# Altium schematic sheet Leddriver.SchDoc: LED meghajtó áramkör
size A4; ENG_APP_DATE: --/--/--; DSN_APP_DATE: --/--/--; CHK_APP_DATE: --/--/--; Author: Horváth Patrik; Organization: BME-AUT; DocumentNumber: 3; Revision: A29; SheetNumber: 3; SheetTotal: 4
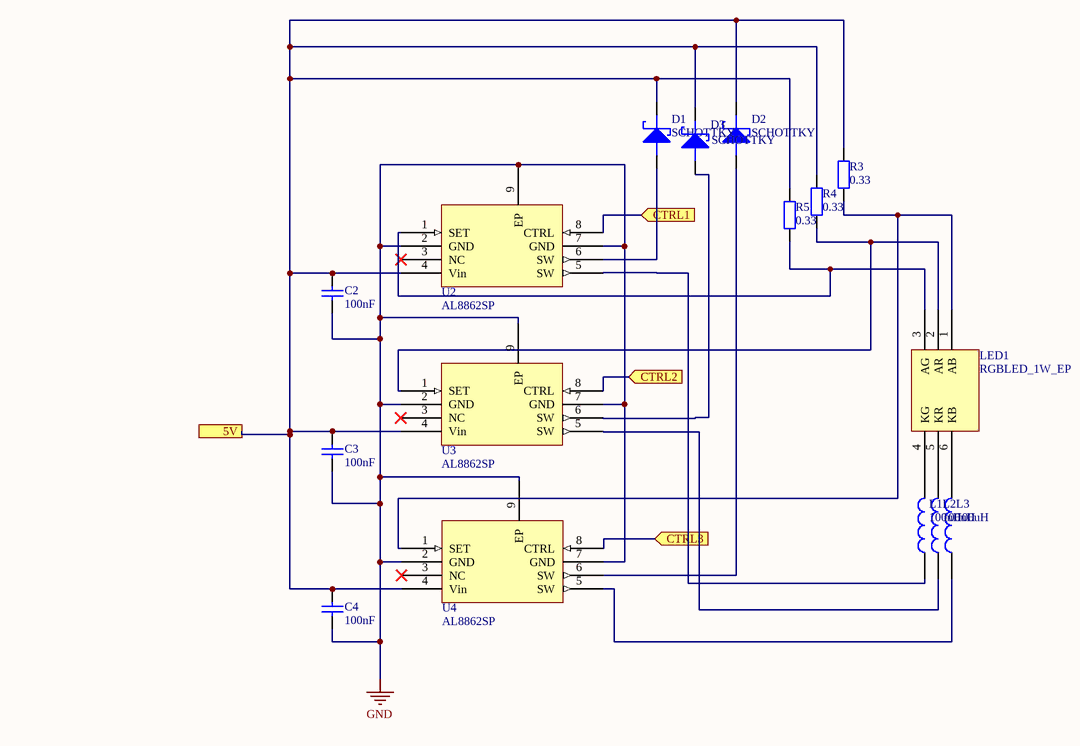
[diagram p0: Leddriver.SchDoc]

## Parts
C2  100nF  [FP_0805_CAP_085]
C3  100nF  [FP_0805_CAP_085]
C4  100nF  [FP_0805_CAP_085]
D1  SCHOTTKY  [FP_SOD-123]
D2  SCHOTTKY  [FP_SOD-123]
D3  SCHOTTKY  [FP_SOD-123]
L1  100uH  [INDP5350X45N]
L2  100uH  [INDP5350X45N]
L3  100uH  [INDP5350X45N]
LED1  RGBLED_1W_EP  [RGBLED_1W_EP]
R3  value 0.33  [FP_0805_RES]  (hidden comment: 0.22)
R4  value 0.33  [FP_0805_RES]  (hidden comment: 0.22)
R5  value 0.33  [FP_0805_RES]  (hidden comment: 0.22)
U2  AL8862SP  [SOIC127P600-8N_LEd_Driver]
U3  AL8862SP  [SOIC127P600-8N_LEd_Driver]
U4  AL8862SP  [SOIC127P600-8N_LEd_Driver]

## Ports
5V, CTRL1 (in), CTRL2 (in), CTRL3 (in)

## Nets
GND: C2.1 C3.1 C4.1 U2.2(GND) U2.7(GND) U2.9(EP) U3.2(GND) U3.7(GND) U3.9(EP) U4.2(GND) U4.7(GND) U4.9(EP)
5V: C2.2 C3.2 C4.2 D1.2(CATHODE) D2.2(CATHODE) D3.2(CATHODE) R3.2 R4.2 R5.2 U2.4(Vin) U3.4(Vin) U4.4(Vin) ; port 5V
CTRL1: U2.8(CTRL) ; port CTRL1
CTRL2: U3.8(CTRL) ; port CTRL2
CTRL3: U4.8(CTRL) ; port CTRL3
NetD1_1: D1.1(ANODE) U2.6(SW)
NetD2_1: D2.1(ANODE) U4.6(SW)
NetD3_1: D3.1(ANODE) U3.6(SW)
NetL1_1: L1.1 U2.5(SW)
NetL1_2: L1.2 LED1.4(KG)
NetL2_1: L2.1 U3.5(SW)
NetL2_2: L2.2 LED1.5(KR)
NetL3_1: L3.1 U4.5(SW)
NetL3_2: L3.2 LED1.6(KB)
NetLED1_1: LED1.1(AB) R3.1 U4.1(SET)
NetLED1_2: LED1.2(AR) R4.1 U3.1(SET)
NetLED1_3: LED1.3(AG) R5.1 U2.1(SET)

Not connected (* = marked no-connect by the designer): U2 3(NC)*; U3 3(NC)*; U4 3(NC)*

## Notes on the sheet
- Title
- Size:
- Date:
- A4
- Number:
- Time:
- Revision:
- Sheet
- of
- File:

## Library data of the parts
C2-C4 = CAP: Capacitor; Name: 100nF 0805 10% 50V X7R 0805B104K500NT; Supplier: Lomex; Reference: 82-13-46; Value: 100nF
D1-D3 = SCHOTTKY: Schottky diode; Name: 1A 40V SCH.RECT.LOW Vf S14; Supplier: Lomex; Reference: 83-03-00
L1-L3 = IND: Inductor; Reference: 3288245; Name: VLS5045EX-101M-H; Supplier: Farnell; Value: 100uH
LED1 = RGBLED_1W_EP: Name: FYLP-1W-RGBB; Reference: 95-03-19; Supplier: Lomex
R3-R5 = RES: Resistor; Name: ERJS6QFR33V 0.33ohm prec ellenállás; Reference: 2381080; Supplier: Farnell
U2-U4 = AL8862SP: Reference: 3518291; Name: AL8862SP; Supplier: Farnell